# EAGLE design convrs485 V2 (EAGLE 4.09)
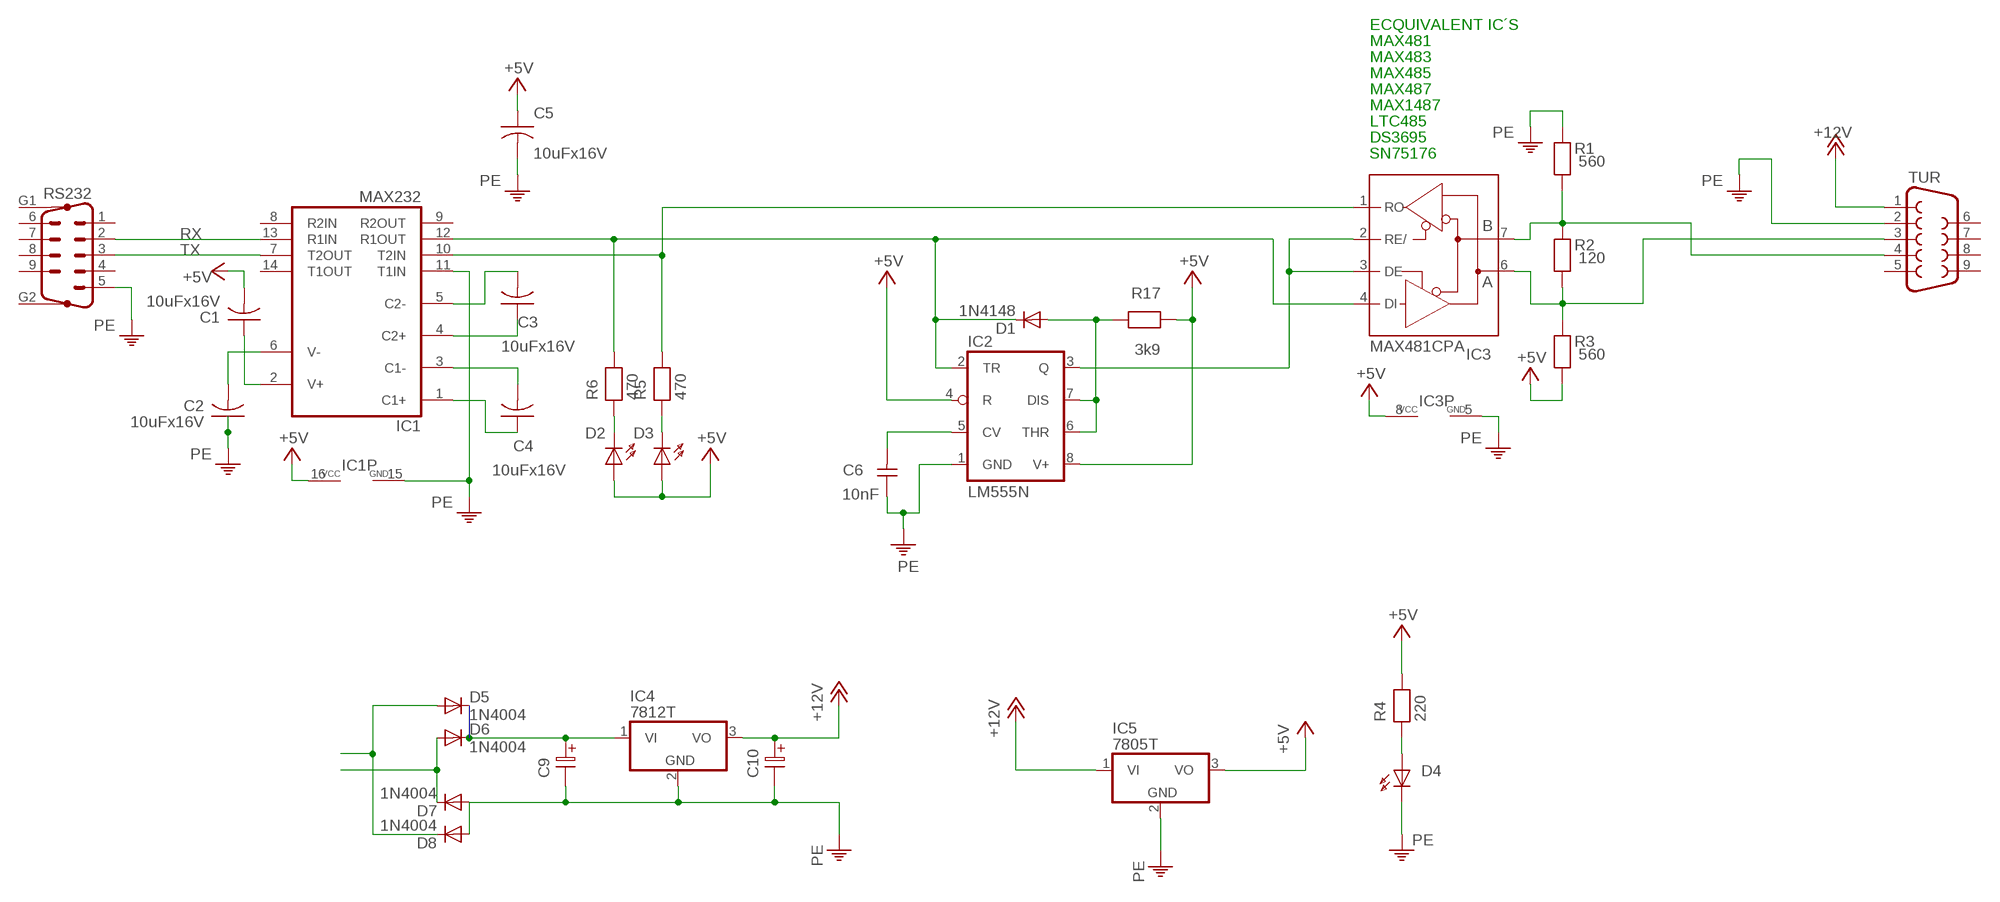
[diagram p0: schematic, sheet 1]

## Parts
C1  10uFx16V  CAP-2,5  [C-2,5]
C2  10uFx16V  CAP-2,5  [C-2,5]
C3  10uFx16V  CAP-2,5  [C-2,5]
C4  10uFx16V  CAP-2,5  [C-2,5]
C5  10uFx16V  CAP-2,5  [C-2,5]
C6  10nF  CAPNP-5  [C-5]
C9  ELC-7,5  [ES-7,5]
C10  ELC-7,5  [ES-7,5]
D1  1N4148  [DO35-10]
D2  LED3MM  [LED3MM]
D3  LED3MM  [LED3MM]
D4  LED3MM  [LED3MM]
D5  1N4004  [DO41-10]
D6  1N4004  [DO41-10]
D7  1N4004  [DO41-10]
D8  1N4004  [DO41-10]
IC1  MAX232  [DIL16]
IC2  LM555N  [DIL08]
IC3  MAX481CPA  [DIL08]
IC4  7812T  [TO220H]
IC5  7805T  [TO220H]
R1  560  RESEU-7,5  [R-7,5]
R2  120  RESEU-7,5  [R-7,5]
R3  560  RESEU-7,5  [R-7,5]
R4  220  RESEU-7,5  [R-7,5]
R5  470  RESEU-7,5  [R-7,5]
R6  470  RESEU-7,5  [R-7,5]
R17  3k9  RESEU-7,5  [R-7,5]
RS232  M09HP  [M09HP]
TUR  F09HP  [F09HP]

## Nets
+5V: C1.2 C5.1 D2.A D3.A IC1.16(VCC) IC2.4(R) IC2.8(V+) IC3.8(VCC) IC5.3(VO) R3.1 R4.2 R17.1
+12V: C10.1 IC4.3(VO) IC5.1(VI) TUR.1
A4: IC3.6(A) R2.1 R3.2 TUR.3
B4: IC3.7(B) R1.1 R2.2 TUR.4
N$1: C3.2 IC1.5(C2-)
N$2: C3.1 IC1.4(C2+)
N$3: C4.2 IC1.3(C1-)
N$4: C1.1 IC1.2(V+)
N$5: C2.2 IC1.6(V-)
N$6: C4.1 IC1.1(C1+)
N$7: C9.1 D5.C D6.C IC4.1(VI)
N$9: IC1.10(T2IN) IC3.1(RO) R5.2
N$11: IC2.3(Q) IC3.2(RE/) IC3.3(DE)
N$12: D5.A D8.C
N$14: D6.A D7.C
N$19: D2.K(C) R6.1
N$20: D3.K(C) R5.1
N$21: D4.A R4.1
N$23: C6.2 IC2.5(CV)
N$27: D1.C IC1.12(R1OUT) IC2.2(TR) IC3.4(DI) R6.2
N$32: D1.A IC2.6(THR) IC2.7(DIS) R17.2
PE: C2.1 C5.2 C6.1 C9.2 C10.2 D4.K(C) D7.A D8.A IC1.11(T1IN) IC1.15(GND) IC2.1(GND) IC3.5(GND) IC4.2(GND) IC5.2(GND) R1.2 RS232.5 TUR.2
RX: IC1.13(R1IN) RS232.2
TX: IC1.7(T2OUT) RS232.3
Unconnected: IC1.8(R2IN) IC1.9(R2OUT) IC1.14(T1OUT) RS232.1 RS232.4 RS232.6 RS232.7 RS232.8 RS232.9 RS232.G1 RS232.G2 TUR.5 TUR.6 TUR.7 TUR.8 TUR.9

## Buses
B$1

## Notes on the sheet
- ECQUIVALENT IC´S
- MAX481
- MAX483
- MAX485
- MAX487
- MAX1487
- LTC485
- DS3695
- SN75176

## Library data of the parts
C1-C5 = discrete:CAP-2,5
C6 = discrete:CAPNP-5
C9 C10 = discrete:ELC-7,5
D1 = diode:1N4148: DIODE high speed (Philips)
D2-D4 = led:LED: LED
D5-D8 = diode:1N4004: DIODE general purpose rectifier, 1 A
IC1 = maxim:MAX232: RS232 TRANSEIVER
IC2 = linear:*555: TIMER
IC3 = maxim:MAX481CPA: RS485 TRANSEIVER
IC4 IC5 = linear:78*: Positive VOLTAGE REGULATOR
R1-R6 R17 = discrete:RESEU-7,5
RS232 = con-subd:M09HP: SUB-D
TUR = con-subd:F09: SUB-D

## Board
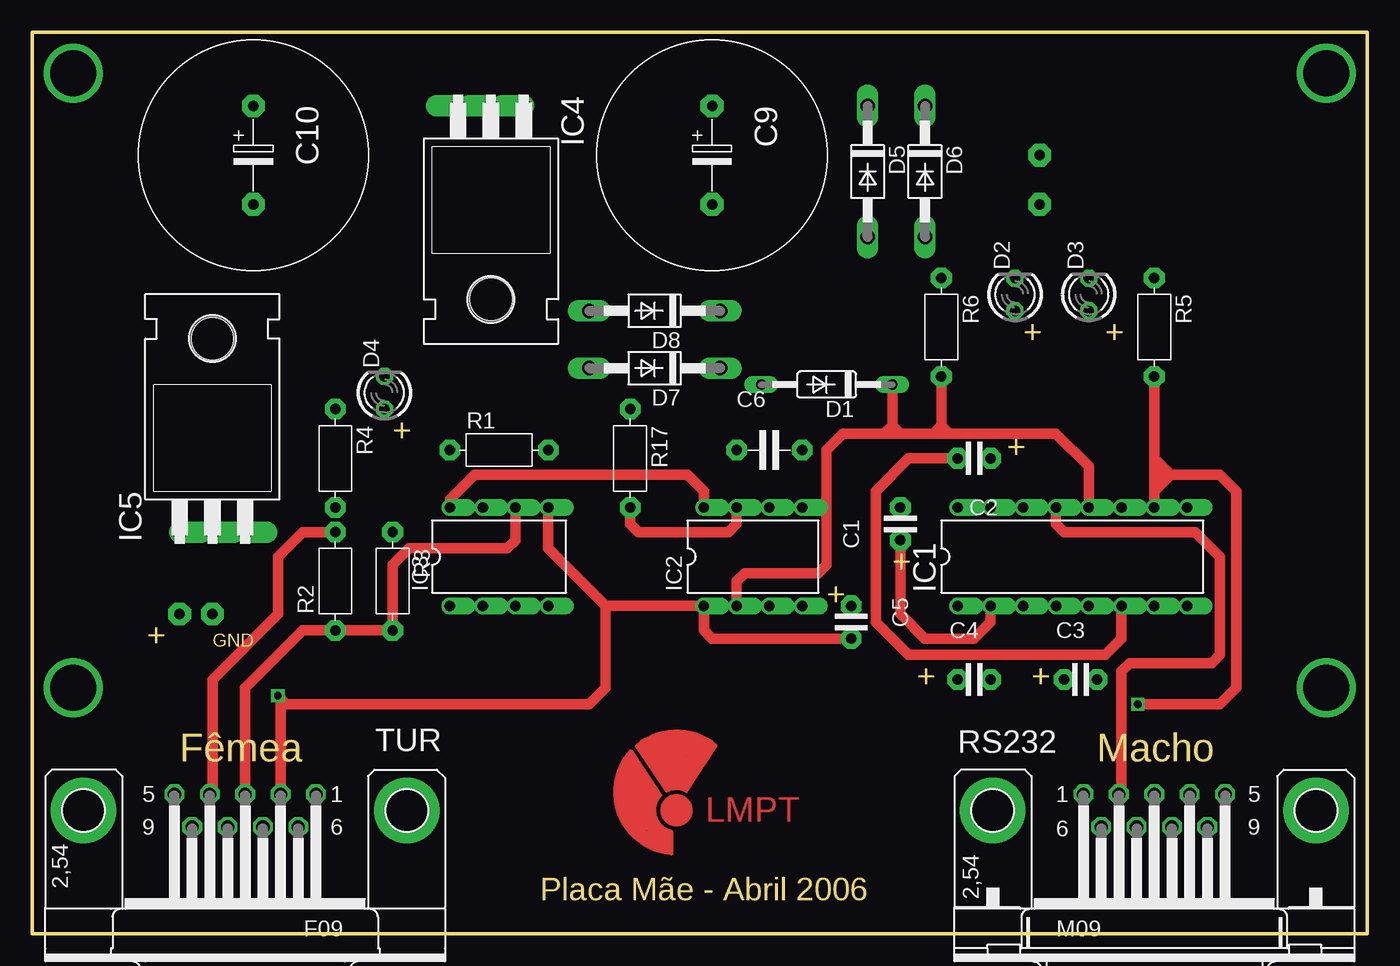
[diagram p1: board, top side]
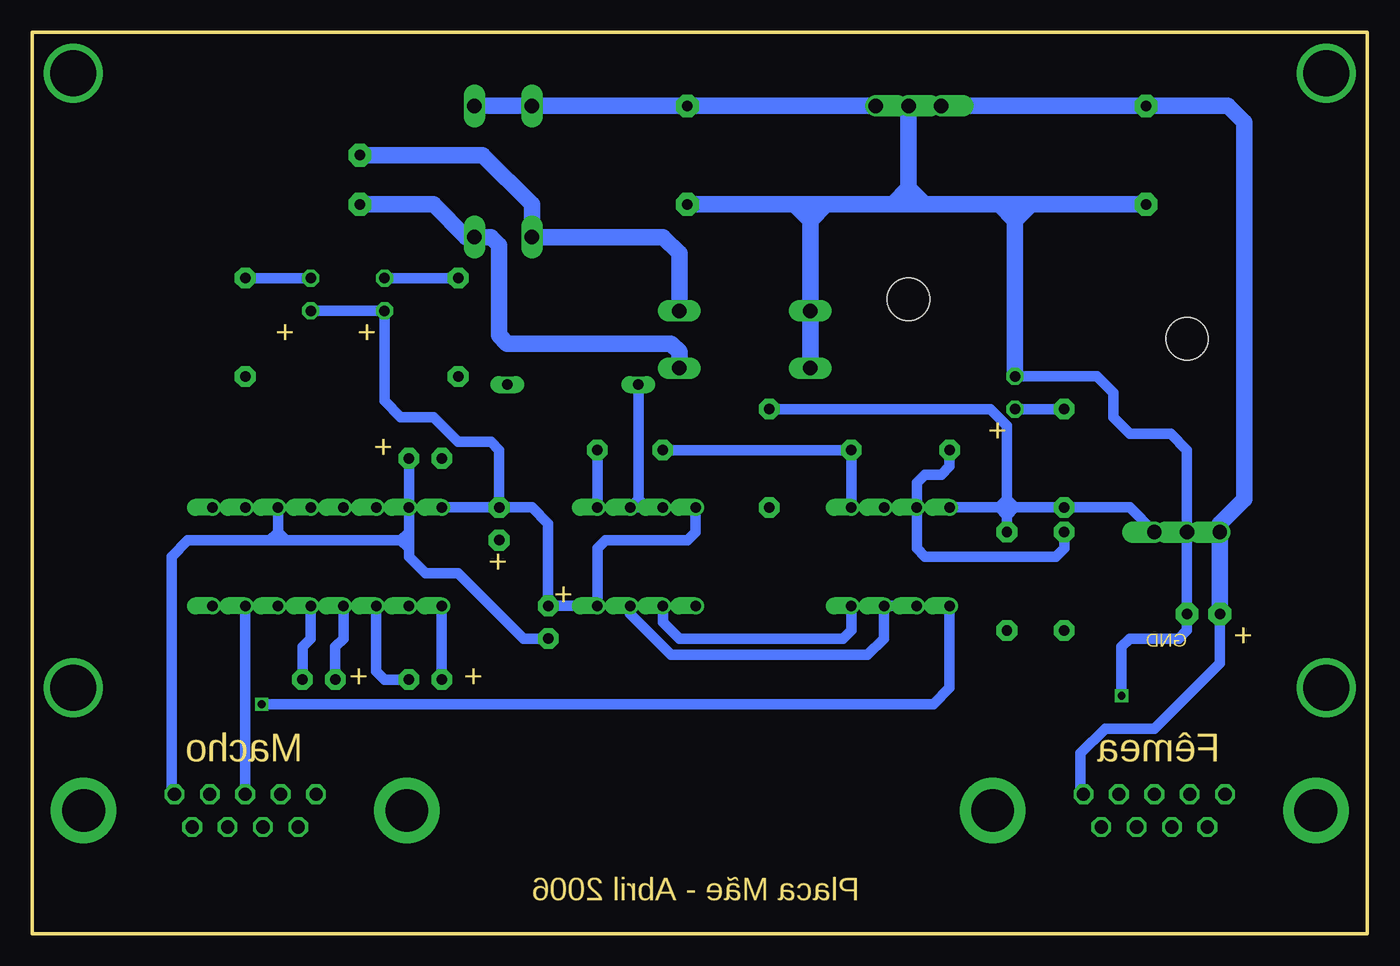
[diagram p2: board, bottom side, seen from below]

Size 103.5 x 69.85 mm. Coordinates in mm from the lower left corner, seen from the top.
Outline: 0,69.85 103.5,69.85 103.5,0 0,0 0,69.85
Copper layers used: Top, Bottom

### Footprints (pad centres in the part's own frame; a part is rotated, then mirrored left to right if it is on the bottom)
C-2,5 = drill 0.813 pad 1.6 octagon: 1 -1.27,0; 2 1.27,0
C-5 = drill 0.813 pad 1.6 octagon: 1 -2.54,0; 2 2.54,0
ES-7,5 = drill 0.813 pad 1.778 octagon: 1 -3.81,0; 2 3.81,0
DO35-10 = drill 0.813 long: A 5.08,0; C -5.08,0
LED3MM = drill 0.813 octagon: A -1.27,0; K 1.27,0
DO41-10 = drill 1.118 long: A 5.08,0; C -5.08,0
DIL16 = drill 0.813 offset: 1 -8.89,-3.81; 2 -6.35,-3.81; 3 -3.81,-3.81; 4 -1.27,-3.81; 5 1.27,-3.81; 6 3.81,-3.81; 7 6.35,-3.81; 8 8.89,-3.81; 9 8.89,3.81; 10 6.35,3.81; 11 3.81,3.81; 12 1.27,3.81; 13 -1.27,3.81; 14 -3.81,3.81; 15 -6.35,3.81; 16 -8.89,3.81
DIL08 = drill 0.813 offset: 1 -3.81,-3.81; 2 -1.27,-3.81; 3 1.27,-3.81; 4 3.81,-3.81; 5 3.81,3.81; 6 1.27,3.81; 7 -1.27,3.81; 8 -3.81,3.81
TO220H = drill 1.118 offset: 1 -2.54,-10.16; 2 0,-10.16; 3 2.54,-10.16 | hole 3.302: 0,4.826
R-7,5 = drill 0.813 pad 1.6 octagon: 1 -3.81,0; 2 3.81,0
M09HP = drill 1.016 octagon: 1 -5.486,1.27; 2 -2.743,1.27; 3 0,1.27; 4 2.743,1.27; 5 5.486,1.27; 6 -4.115,-1.27; 7 -1.372,-1.27; 8 1.372,-1.27; 9 4.115,-1.27 | drill 3.302 pad 5.08 round: G1 -12.522,0; G2 12.522,0
F09HP = drill 1.016 octagon: 1 -5.486,-1.27; 2 -2.743,-1.27; 3 0,-1.27; 4 2.743,-1.27; 5 5.486,-1.27; 6 -4.115,1.27; 7 -1.372,1.27; 8 1.372,1.27; 9 4.115,1.27 | drill 3.302 pad 5.08 round: G1 -12.522,0; G2 12.522,0

### Placement (x,y rotation side)
C1  67.31,31.75 90 top
C2  73.02,36.83 180 top
C3  81.28,19.69 0 top
C4  73.02,19.69 0 top
C5  63.5,24.13 270 top
C6  57.15,37.46 0 top
C9  52.7,60.33 270 top
C10  17.14,60.33 270 top
D1  61.59,42.55 180 top
D2  76.2,49.53 90 top
D3  81.91,49.53 90 top
D4  27.3,41.91 90 top
D5  64.77,59.05 270 top
D6  69.22,59.05 270 top
D7  48.26,43.81 180 top
D8  48.26,48.26 180 top
IC1  80.64,29.21 0 top
IC2  55.88,29.21 0 top
IC3  36.2,29.21 0 top
IC4  35.56,53.97 180 top
IC5  13.97,41.27 0 top
R1  36.2,37.46 0 top
R2  23.5,27.3 90 top
R3  27.94,27.3 270 top
R4  23.5,36.83 270 top
R5  86.99,46.99 270 top
R6  70.48,46.99 270 top
R17  46.35,36.83 270 top
RS232  86.99,9.53 0 top
TUR  16.51,9.53 180 top

### Tracks (layer width: path | path; a pad name or v marks a point on that pad's centre or on a via)
+5V
  Top 0.813: IC3.8 32.38,33.66 34.29,35.56 50.8,35.56 52.07,34.29 IC2.8
  Bottom 0.813: C1.2 IC1.16 C1.2 | IC2.8 52.07,31.11 52.7,30.48 59.05,30.48 59.69,29.84 IC2.4 C5.1 63.5,31.75 64.77,33.02 C1.2 | 28.57,33.02 IC3.8 | 27.94,32.38 28.57,33.02 | R17.1 29.21,40.64 27.94,39.37 27.94,33.66 | 27.94,33.02 27.94,33.66 | 27.94,33.66 28.57,33.02 | 27.94,32.38 R3.1 | 27.94,33.02 27.94,32.38 | 27.3,33.02 27.94,33.02 | IC5.3 18.41,33.02 R4.2 27.3,33.02 | 27.3,33.02 27.94,32.38 | 27.3,33.02 27.94,33.66 | D3.A D2.A 76.2,41.27 74.93,40 72.39,40 70.48,38.1 67.94,38.1 67.31,37.46 C1.2
+12V  (via drill 0.81 pad 1.78)
  Bottom 0.813: 11.43,25.4 v11.43,24.77 11.43,20.95 16.51,15.88 20.32,15.88 22.23,13.97 22.23,10.79 TUR.1 | C10.1 IC4.3
  Bottom 1.27: 11.43,25.4 IC5.1 11.43,31.75 9.52,33.66 9.52,62.86 10.79,64.14 C10.1 IC4.3
A4
  Top 0.813: IC3.6 37.46,30.48 36.83,29.84 29.21,29.84 27.94,28.57 R3.2 R2.1 20.96,23.49 16.51,19.05 TUR.3
B4
  Top 0.813: R2.2 20.96,31.11 19.05,29.21 19.05,24.77 13.97,19.69 13.97,10.79 TUR.4
  Bottom 0.813: R1.1 32.38,36.2 33.02,35.56 34.29,35.56 34.92,34.92 IC3.7 34.92,29.84 34.29,29.21 24.13,29.21 23.5,29.84 R2.2
N$1
  Bottom 0.813: IC1.5 81.91,22.86 82.55,22.23 C3.2
N$2
  Bottom 0.813: IC1.4 79.38,22.86 80.01,22.23 C3.1
N$3
  Bottom 0.813: C4.2 76.2,19.69 76.83,20.32 IC1.3
N$4
  Top 0.813: C1.1 67.31,24.77 69.22,22.86 73.02,22.86 74.3,24.13 IC1.2
N$5
  Top 0.813: C2.2 67.94,36.83 65.41,34.29 65.41,24.13 67.94,21.59 83.19,21.59 84.45,22.86 IC1.6
N$6
  Bottom 0.813: C4.1 IC1.1
N$7
  Bottom 1.27: IC4.1 C9.1 D5.C D6.C
N$9  (via drill 0.61)
  Top 0.813: v85.72,17.78 92.08,17.78 93.34,19.05 93.34,34.29 92.08,35.56 88.27,35.56 | 88.27,35.56 86.99,34.29 IC1.10 86.99,36.83 | 88.27,35.56 86.99,36.83 | 88.27,35.56 87.63,35.56 | 86.99,36.83 R5.2
  Bottom 0.813: IC3.1 32.38,19.05 33.66,17.78 v85.72,17.78
N$10
  Top 0.254: 49.56,6.18 49.56,7.9
N$11
  Bottom 0.813: IC2.3 57.15,24.77 53.97,21.59 38.73,21.59 37.46,22.86 IC3.3 IC3.2
N$12  (via drill 0.81 pad 1.78)
  Bottom 1.27: D8.C 53.34,52.7 54.61,53.97 D5.A 64.77,56.52 68.58,60.33 v78.11,60.33
N$13  (via drill 3.56 pad 2.54)
  other vias: 100.33,66.67
N$14  (via drill 0.81 pad 1.78)
  Bottom 0.813: 65.41,45.72 66.04,45.72
  Bottom 1.27: D7.C 53.34,45.09 53.97,45.72 65.41,45.72 66.67,45.72 67.31,46.35 67.31,53.34 67.94,53.97 D6.A 69.85,53.97 72.39,56.52 v78.11,56.52
N$15  (via drill 3.56 pad 2.54)
  other vias: 3.17,66.67
N$16  (via drill 3.56 pad 2.54)
  other vias: 3.17,19.05
N$17  (via drill 3.56 pad 2.54)
  other vias: 100.33,19.05
N$18
  Top 0.254: 48.69,10.73 46.41,14.13
N$19
  Bottom 0.813: R6.1 D2.K
N$20
  Bottom 0.813: D3.K R5.1
N$21
  Bottom 0.813: R4.1 D4.A
N$22
  Top 0.254: 46.86,14.53 49.16,11.08
N$23
  Bottom 0.813: IC2.5 C6.2
N$24
  Top 0.254: 50.69,11.08 52.96,14.56
N$25
  Top 0.61: 47.27,14.51 49.28,11.41 49.89,11.62 47.68,14.76 48.79,15.22 50.47,15.45 51.62,15.17 52.61,14.51 50.53,11.49 50.16,11.52 48.35,14.75 50.55,15.06 52.12,14.29 50.26,11.69 49.07,14.76 51.74,14.09 50.38,12.35 49.67,14.55 51.25,13.88 50.43,13.08 50.36,14.03 50.52,15.11
N$26
  Top 0.61: 46.34,13.65 45.51,11.92 45.47,10.58 45.77,9.3 46.2,8.44 47.06,7.6 48.09,6.84 49.33,6.5 49.18,7.71 48.15,8.54 47.95,9.7 48.06,10.2 48.32,10.75 46.6,13.27 46.15,12.5 46.48,12.47 47.88,10.44 47.65,9.99 45.95,12.27 45.97,9.27 48.11,7.04 49.05,7.19 48.38,7.95 48.21,7.39 47.8,8.31 47.1,8.45 47.78,8.92 46.67,8.88 47.72,9.57 46.27,9.26 47.38,9.97 46.15,9.84 46.95,10.36 46.28,10.6 46.47,11.22
N$27
  Top 0.813: IC1.12 81.91,36.2 79.38,38.73 71.12,38.73 | IC2.2 54.61,27.3 55.24,27.94 60.96,27.94 61.59,28.57 61.59,37.46 62.86,38.73 66.04,38.73 | 66.04,38.73 67.31,38.73 | 67.31,38.73 69.85,38.73 | 69.85,38.73 71.12,38.73 | 66.67,39.37 D1.C | 66.04,38.73 66.67,39.37 | 67.31,38.73 66.67,39.37 | 71.12,38.73 70.48,39.37 | 69.85,38.73 70.48,39.37 | 70.48,39.37 R6.2
  Bottom 0.813: IC2.2 54.61,24.13 53.34,22.86 42.54,22.86 | 40,24.77 IC3.4 40,23.49 40.64,22.86 42.54,22.86 | 42.54,22.86 41.91,22.86
N$32
  Top 0.813: R17.2 46.35,31.75 46.99,31.11 53.97,31.11 54.61,31.75 IC2.7
  Bottom 0.813: 56.52,33.02 IC2.6 56.52,33.66 | IC2.7 55.88,33.02 | 55.88,33.02 56.52,33.02 | 56.52,33.02 56.52,33.66 | 56.52,33.66 D1.A | 55.88,33.02 56.52,33.66
PE  (via drill 0.61, 0.81 pad 1.78)
  Top 0.813: C5.2 52.7,22.86 52.07,23.49 IC2.1 44.45,25.4 | TUR.2 19.25,18.21 v19.05,18.41 19.69,17.78 43.18,17.78 44.45,19.05 44.45,25.4 | IC3.5 40,29.84 44.45,25.4
  Bottom 0.813: 84.45,31.11 85.09,30.48 | 85.09,30.48 91.44,30.48 92.71,29.21 92.71,10.79 RS232.5 | 84.45,31.11 IC1.11 | 83.82,30.48 84.45,31.11 | 74.3,31.11 74.93,30.48 | 74.3,31.11 IC1.15 C2.1 | 83.82,30.48 85.09,30.48 | 74.3,29.84 74.3,29.21 73.02,27.94 70.48,27.94 65.41,22.86 C5.2 | 74.3,29.84 74.3,31.11 | 74.93,30.48 83.82,30.48 | 74.3,29.84 74.93,30.48 | C6.1 R1.2 IC3.5 | 35.56,57.15 36.2,56.52 35.56,56.52 | D4.K 20.96,43.18 19.69,41.91 19.69,40 18.41,38.73 15.24,38.73 13.97,37.46 IC5.2 v13.97,24.77 13.97,23.49 14.61,22.86 18.41,22.86 19.05,22.23 v19.05,18.41 | 27.3,55.88 27.3,56.52 | D7.A D8.A | 43.18,55.88 43.18,56.52
  Bottom 1.27: 26.04,56.52 26.67,56.52 | 26.04,56.52 C10.2 | 26.67,56.52 27.3,56.52 27.94,56.52 | 28.57,56.52 27.94,56.52 | 28.57,56.52 33.66,56.52 | 33.66,56.52 34.92,56.52 | 34.92,56.52 35.56,57.15 | 34.92,56.52 35.56,56.52 | 35.56,56.52 36.83,56.52 | 36.83,56.52 41.91,56.52 | 41.91,56.52 42.54,56.52 | 42.54,56.52 43.18,56.52 44.45,56.52 | 44.45,56.52 C9.2 | 35.56,57.78 35.56,56.52 | 35.56,57.78 IC4.2 | D4.K 27.3,55.25 | 27.3,55.25 27.3,55.88 | 27.3,55.88 27.94,56.52 | 27.3,55.88 26.67,56.52 | 43.18,55.25 43.18,55.88 | 43.18,55.25 D7.A | 44.45,56.52 43.81,56.52 43.18,55.88 | 42.54,56.52 43.18,55.88 | 33.66,56.52 34.29,56.52 35.56,57.78 | 35.56,57.78 36.83,56.52 | 43.18,55.25 44.45,56.52 | 41.91,56.52 43.18,55.25 | 27.3,55.25 26.04,56.52 | 27.3,55.25 28.57,56.52
RX
  Top 0.813: IC1.13 79.38,31.75 80.01,31.11 90.17,31.11 92.08,29.21 92.08,21.59 91.44,20.95 85.09,20.95 84.45,20.32 84.45,10.79 RS232.2
TX
  Bottom 0.813: RS232.3 IC1.7
(copper drawn outside any net)
  Top 0.254: 48.79,10.81 arc125 49.56,7.9 | 49.14,11.06 arc-58 50.79,11.01 | 46.41,14.15 arc128 49.59,6.21 | 46.84,14.53 arc-82 53.06,14.53
  shapes: Top circle x2

### Text on the board
Top: LMPT
Dimension: + | + | + | + | + | + | + | GND | + | + | Fêmea | Macho | Placa Mãe - Abril 2006